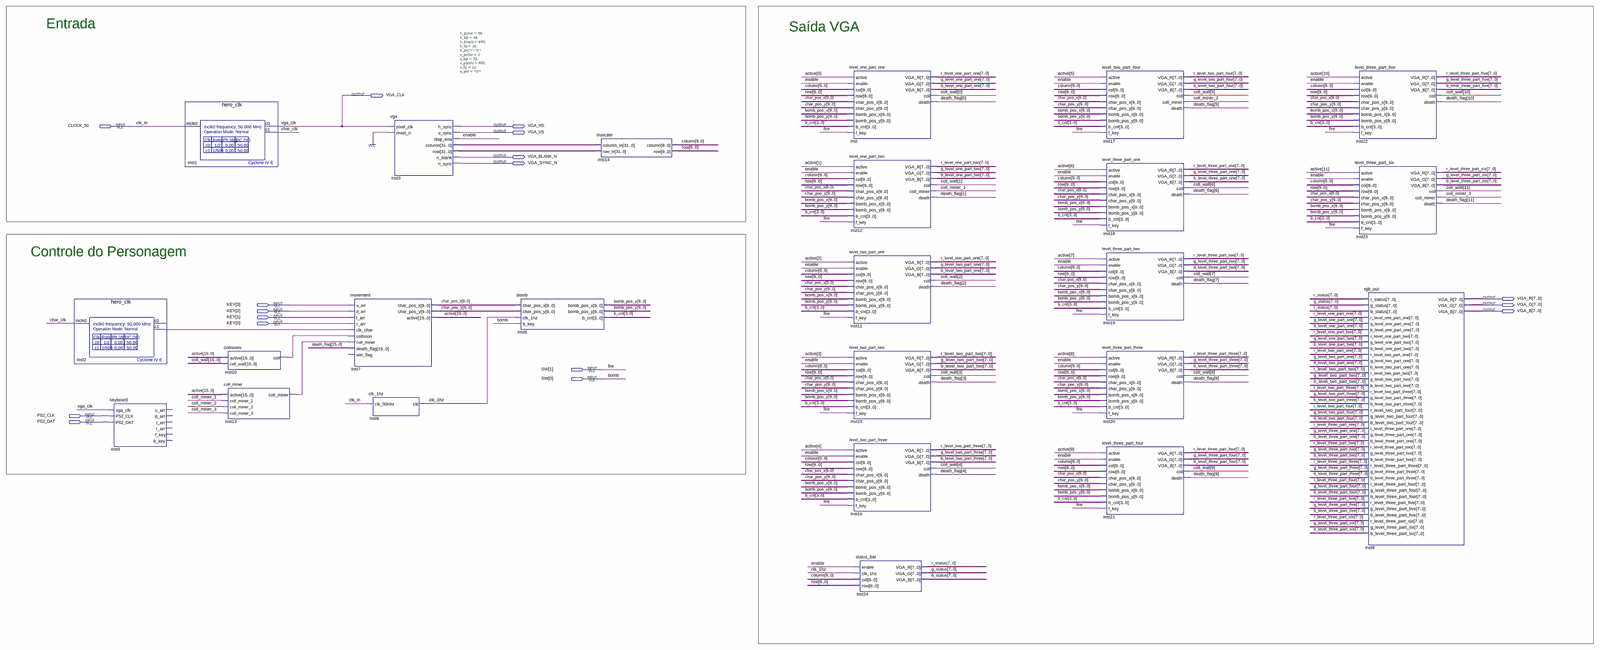
[diagram p0: schematic sheet, whole]
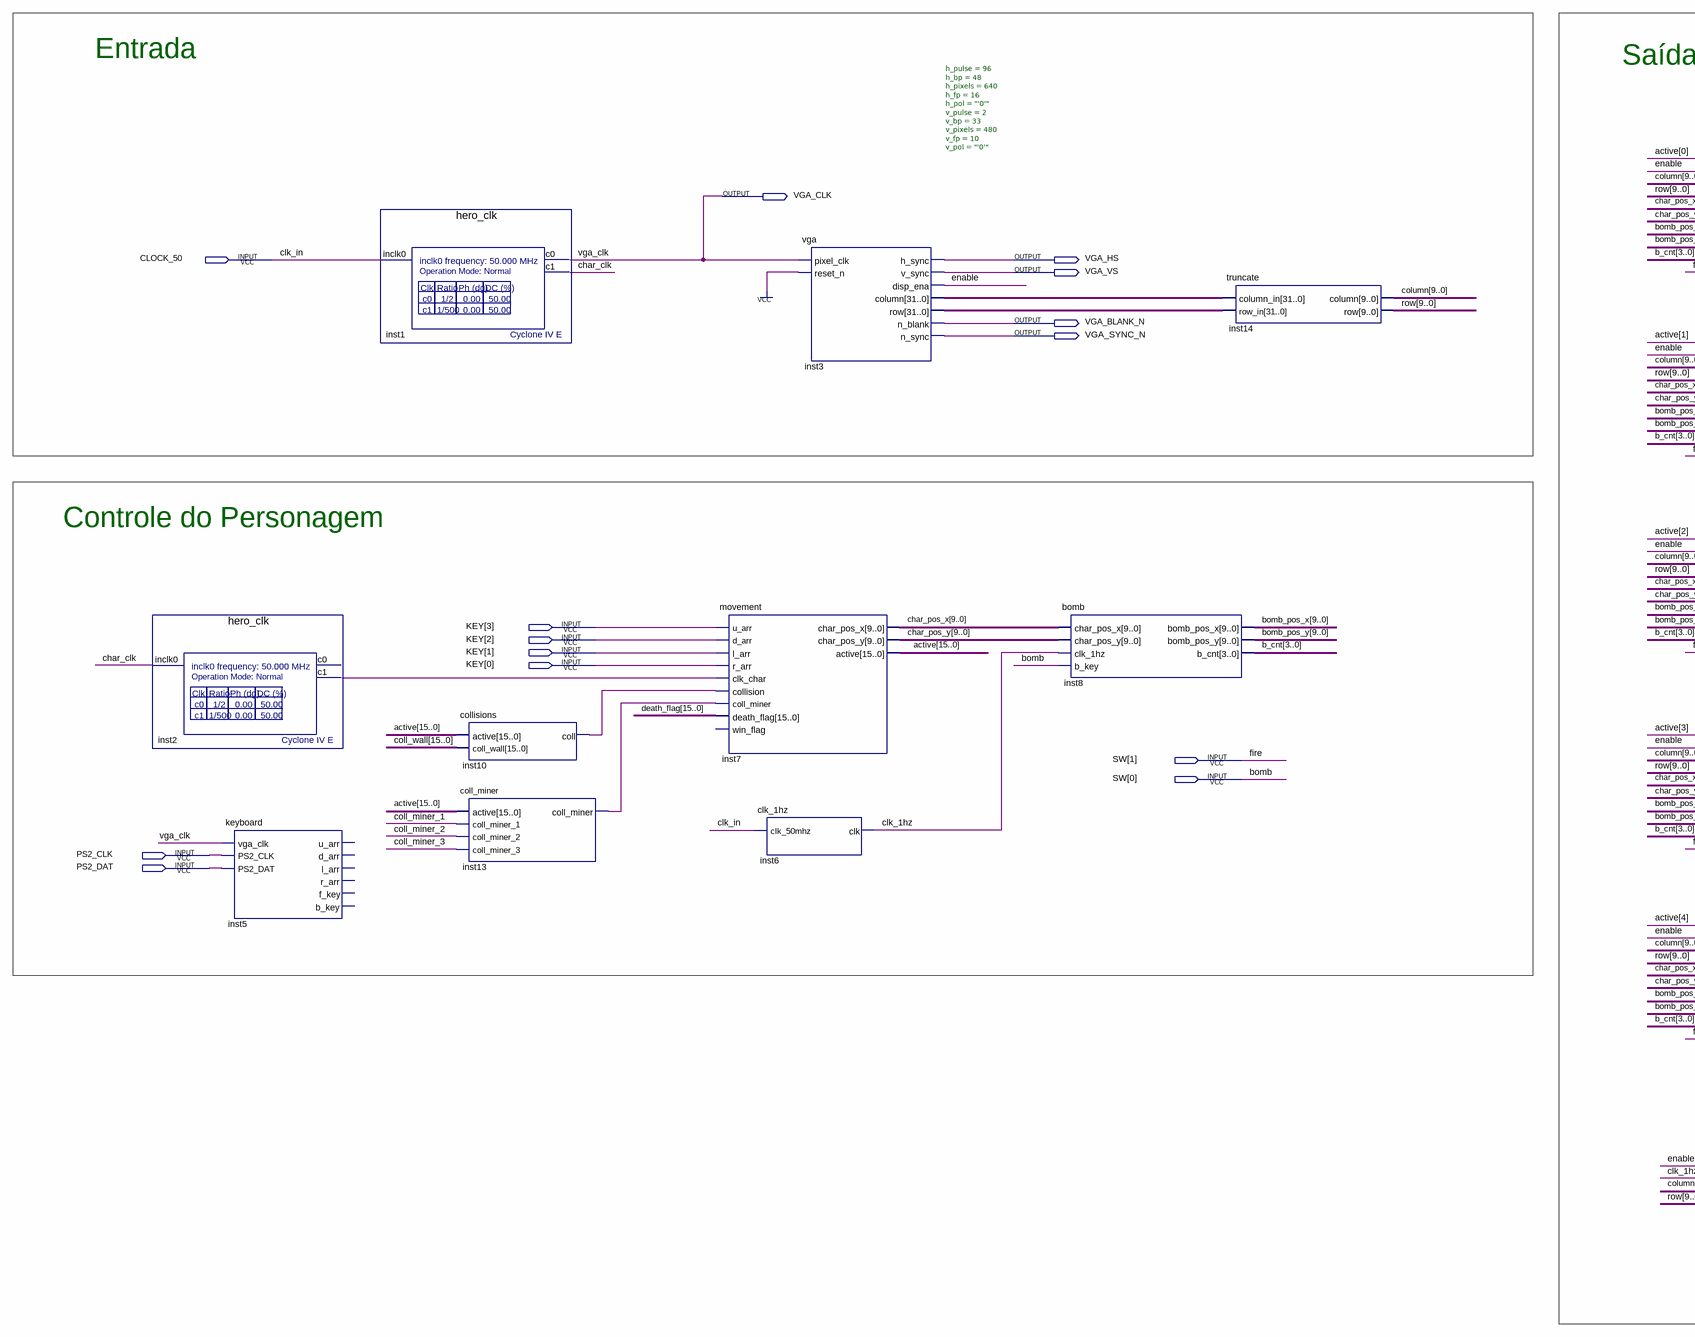
[diagram p1: schematic sheet, left part]
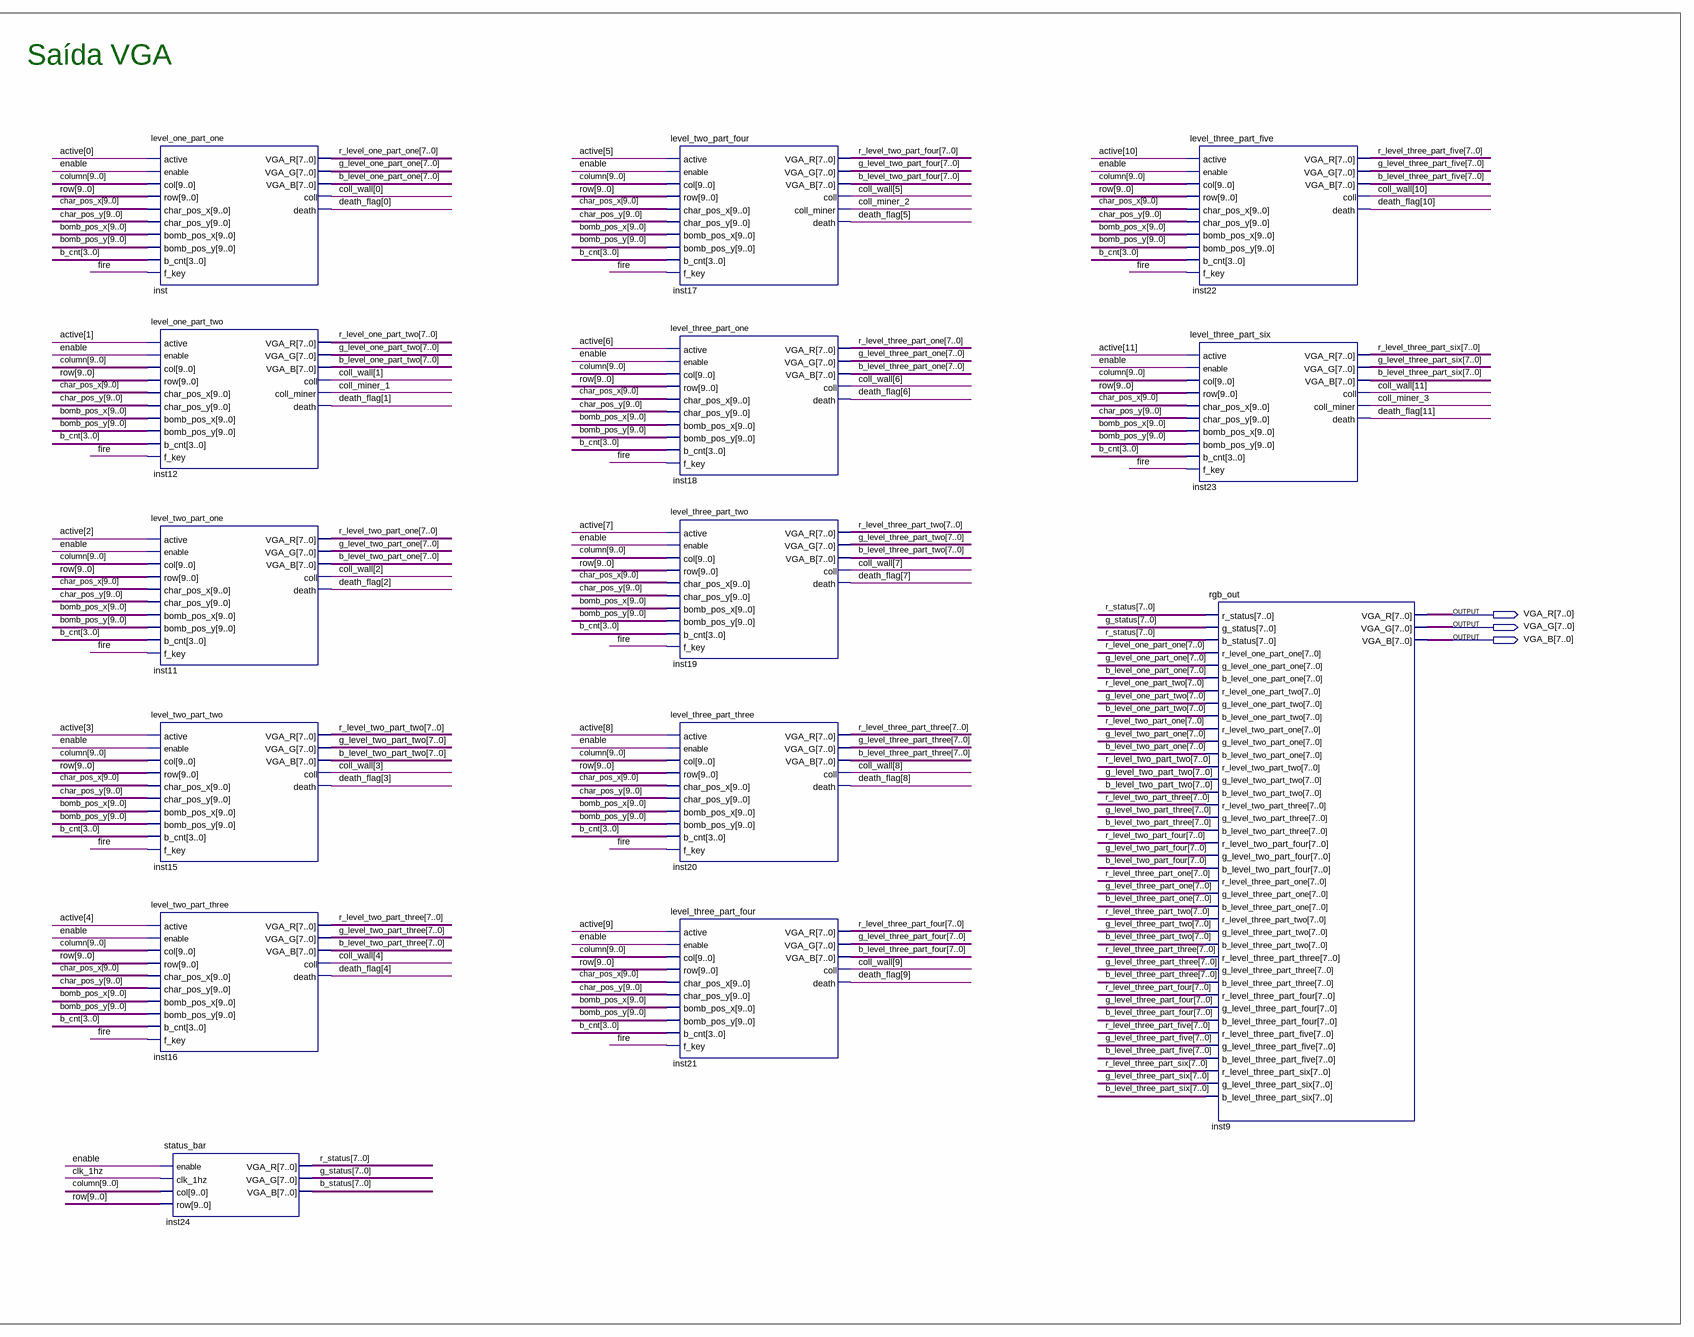
[diagram p2: schematic sheet, right part]
// Quartus schematic hero.bdf as structural Verilog: 24 symbols, 17 pins
module hero (
  input  CLOCK_50,
  input  [3:0] KEY,
  input  [1:0] SW,
  input  PS2_CLK,
  input  PS2_DAT,
  output VGA_CLK,
  output VGA_HS,
  output VGA_VS,
  output VGA_BLANK_N,
  output VGA_SYNC_N,
  output [7:0] VGA_R,
  output [7:0] VGA_G,
  output [7:0] VGA_B
);

  wire char_clk, clk_1hz, coll_miner_1, coll_miner_2, coll_miner_3, enable, inst2_c1, inst10_coll,
       inst13_coll_miner;
  wire [3:0] b_cnt;
  wire [7:0] b_level_one_part_one, b_level_one_part_two, b_level_three_part_five, b_level_three_part_four,
       b_level_three_part_one, b_level_three_part_six, b_level_three_part_three, b_level_three_part_two,
       b_level_two_part_four, b_level_two_part_one, b_level_two_part_three, b_level_two_part_two, b_status,
       g_level_one_part_one, g_level_one_part_two, g_level_three_part_five, g_level_three_part_four,
       g_level_three_part_one, g_level_three_part_six, g_level_three_part_three, g_level_three_part_two,
       g_level_two_part_four, g_level_two_part_one, g_level_two_part_three, g_level_two_part_two, g_status,
       r_level_one_part_one, r_level_one_part_two, r_level_three_part_five, r_level_three_part_four,
       r_level_three_part_one, r_level_three_part_six, r_level_three_part_three, r_level_three_part_two,
       r_level_two_part_four, r_level_two_part_one, r_level_two_part_three, r_level_two_part_two, r_status;
  wire [9:0] bomb_pos_x, bomb_pos_y, char_pos_x, char_pos_y, column, row;
  wire [15:0] active, coll_wall, death_flag;
  wire [31:0] inst3_column, inst3_row;

  hero_clk inst2 (.inclk0(char_clk), .c1(inst2_c1));  // open: c0
  keyboard inst5 (
    .vga_clk(VGA_CLK), .PS2_CLK(PS2_CLK), .PS2_DAT(PS2_DAT));  // open: u_arr, d_arr, l_arr, r_arr, f_key, b_key
  hero_clk inst1 (.inclk0(CLOCK_50), .c0(VGA_CLK), .c1(char_clk));
  collisions inst10 (.active(active), .coll_wall(coll_wall), .coll(inst10_coll));
  coll_miner inst13 (
    .active(active), .coll_miner_1(coll_miner_1), .coll_miner_2(coll_miner_2), .coll_miner_3(coll_miner_3),
    .coll_miner(inst13_coll_miner));
  movement inst7 (
    .u_arr(KEY[3]), .d_arr(KEY[2]), .l_arr(KEY[1]), .r_arr(KEY[0]), .clk_char(inst2_c1),
    .collision(inst10_coll), .coll_miner(inst13_coll_miner), .death_flag(death_flag),
    .char_pos_x(char_pos_x), .char_pos_y(char_pos_y), .active(active));  // open: win_flag
  clk_1hz inst6 (.clk_50mhz(CLOCK_50), .clk(clk_1hz));
  vga #(.h_pulse(96), .h_bp(48), .h_pixels(640), .h_fp(16), .h_pol("'0'"), .v_pulse(2), .v_bp(33), .v_pixels(480), .v_fp(10), .v_pol("'0'")) inst3 (
    .pixel_clk(VGA_CLK), .reset_n(1'b1), .h_sync(VGA_HS), .v_sync(VGA_VS), .disp_ena(enable),
    .column(inst3_column), .row(inst3_row), .n_blank(VGA_BLANK_N), .n_sync(VGA_SYNC_N));
  bomb inst8 (
    .char_pos_x(char_pos_x), .char_pos_y(char_pos_y), .clk_1hz(clk_1hz), .b_key(SW[0]),
    .bomb_pos_x(bomb_pos_x), .bomb_pos_y(bomb_pos_y), .b_cnt(b_cnt));
  truncate inst14 (.column_in(inst3_column), .row_in(inst3_row), .column(column), .row(row));
  level_one_part_one inst (
    .active(active[0]), .enable(enable), .col(column), .row(row), .char_pos_x(char_pos_x),
    .char_pos_y(char_pos_y), .bomb_pos_x(bomb_pos_x), .bomb_pos_y(bomb_pos_y), .b_cnt(b_cnt), .f_key(SW[1]),
    .VGA_R(r_level_one_part_one), .VGA_G(g_level_one_part_one), .VGA_B(b_level_one_part_one),
    .coll(coll_wall[0]), .death(death_flag[0]));
  level_one_part_two inst12 (
    .active(active[1]), .enable(enable), .col(column), .row(row), .char_pos_x(char_pos_x),
    .char_pos_y(char_pos_y), .bomb_pos_x(bomb_pos_x), .bomb_pos_y(bomb_pos_y), .b_cnt(b_cnt), .f_key(SW[1]),
    .VGA_R(r_level_one_part_two), .VGA_G(g_level_one_part_two), .VGA_B(b_level_one_part_two),
    .coll(coll_wall[1]), .coll_miner(coll_miner_1), .death(death_flag[1]));
  level_two_part_one inst11 (
    .active(active[2]), .enable(enable), .col(column), .row(row), .char_pos_x(char_pos_x),
    .char_pos_y(char_pos_y), .bomb_pos_x(bomb_pos_x), .bomb_pos_y(bomb_pos_y), .b_cnt(b_cnt), .f_key(SW[1]),
    .VGA_R(r_level_two_part_one), .VGA_G(g_level_two_part_one), .VGA_B(b_level_two_part_one),
    .coll(coll_wall[2]), .death(death_flag[2]));
  level_two_part_two inst15 (
    .active(active[3]), .enable(enable), .col(column), .row(row), .char_pos_x(char_pos_x),
    .char_pos_y(char_pos_y), .bomb_pos_x(bomb_pos_x), .bomb_pos_y(bomb_pos_y), .b_cnt(b_cnt), .f_key(SW[1]),
    .VGA_R(r_level_two_part_two), .VGA_G(g_level_two_part_two), .VGA_B(b_level_two_part_two),
    .coll(coll_wall[3]), .death(death_flag[3]));
  level_two_part_three inst16 (
    .active(active[4]), .enable(enable), .col(column), .row(row), .char_pos_x(char_pos_x),
    .char_pos_y(char_pos_y), .bomb_pos_x(bomb_pos_x), .bomb_pos_y(bomb_pos_y), .b_cnt(b_cnt), .f_key(SW[1]),
    .VGA_R(r_level_two_part_three), .VGA_G(g_level_two_part_three), .VGA_B(b_level_two_part_three),
    .coll(coll_wall[4]), .death(death_flag[4]));
  status_bar inst24 (
    .enable(enable), .clk_1hz(clk_1hz), .col(column), .row(row), .VGA_R(r_status), .VGA_G(g_status),
    .VGA_B(b_status));
  level_two_part_four inst17 (
    .active(active[5]), .enable(enable), .col(column), .row(row), .char_pos_x(char_pos_x),
    .char_pos_y(char_pos_y), .bomb_pos_x(bomb_pos_x), .bomb_pos_y(bomb_pos_y), .b_cnt(b_cnt), .f_key(SW[1]),
    .VGA_R(r_level_two_part_four), .VGA_G(g_level_two_part_four), .VGA_B(b_level_two_part_four),
    .coll(coll_wall[5]), .coll_miner(coll_miner_2), .death(death_flag[5]));
  level_three_part_one inst18 (
    .active(active[6]), .enable(enable), .col(column), .row(row), .char_pos_x(char_pos_x),
    .char_pos_y(char_pos_y), .bomb_pos_x(bomb_pos_x), .bomb_pos_y(bomb_pos_y), .b_cnt(b_cnt), .f_key(SW[1]),
    .VGA_R(r_level_three_part_one), .VGA_G(g_level_three_part_one), .VGA_B(b_level_three_part_one),
    .coll(coll_wall[6]), .death(death_flag[6]));
  level_three_part_two inst19 (
    .active(active[7]), .enable(enable), .col(column), .row(row), .char_pos_x(char_pos_x),
    .char_pos_y(char_pos_y), .bomb_pos_x(bomb_pos_x), .bomb_pos_y(bomb_pos_y), .b_cnt(b_cnt), .f_key(SW[1]),
    .VGA_R(r_level_three_part_two), .VGA_G(g_level_three_part_two), .VGA_B(b_level_three_part_two),
    .coll(coll_wall[7]), .death(death_flag[7]));
  level_three_part_three inst20 (
    .active(active[8]), .enable(enable), .col(column), .row(row), .char_pos_x(char_pos_x),
    .char_pos_y(char_pos_y), .bomb_pos_x(bomb_pos_x), .bomb_pos_y(bomb_pos_y), .b_cnt(b_cnt), .f_key(SW[1]),
    .VGA_R(r_level_three_part_three), .VGA_G(g_level_three_part_three), .VGA_B(b_level_three_part_three),
    .coll(coll_wall[8]), .death(death_flag[8]));
  level_three_part_four inst21 (
    .active(active[9]), .enable(enable), .col(column), .row(row), .char_pos_x(char_pos_x),
    .char_pos_y(char_pos_y), .bomb_pos_x(bomb_pos_x), .bomb_pos_y(bomb_pos_y), .b_cnt(b_cnt), .f_key(SW[1]),
    .VGA_R(r_level_three_part_four), .VGA_G(g_level_three_part_four), .VGA_B(b_level_three_part_four),
    .coll(coll_wall[9]), .death(death_flag[9]));
  level_three_part_five inst22 (
    .active(active[10]), .enable(enable), .col(column), .row(row), .char_pos_x(char_pos_x),
    .char_pos_y(char_pos_y), .bomb_pos_x(bomb_pos_x), .bomb_pos_y(bomb_pos_y), .b_cnt(b_cnt), .f_key(SW[1]),
    .VGA_R(r_level_three_part_five), .VGA_G(g_level_three_part_five), .VGA_B(b_level_three_part_five),
    .coll(coll_wall[10]), .death(death_flag[10]));
  level_three_part_six inst23 (
    .active(active[11]), .enable(enable), .col(column), .row(row), .char_pos_x(char_pos_x),
    .char_pos_y(char_pos_y), .bomb_pos_x(bomb_pos_x), .bomb_pos_y(bomb_pos_y), .b_cnt(b_cnt), .f_key(SW[1]),
    .VGA_R(r_level_three_part_six), .VGA_G(g_level_three_part_six), .VGA_B(b_level_three_part_six),
    .coll(coll_wall[11]), .coll_miner(coll_miner_3), .death(death_flag[11]));
  rgb_out inst9 (
    .r_status(r_status), .g_status(g_status), .b_status(r_status),
    .r_level_one_part_one(r_level_one_part_one), .g_level_one_part_one(g_level_one_part_one),
    .b_level_one_part_one(b_level_one_part_one), .r_level_one_part_two(r_level_one_part_two),
    .g_level_one_part_two(g_level_one_part_two), .b_level_one_part_two(b_level_one_part_two),
    .r_level_two_part_one(r_level_two_part_one), .g_level_two_part_one(g_level_two_part_one),
    .b_level_two_part_one(b_level_two_part_one), .r_level_two_part_two(r_level_two_part_two),
    .g_level_two_part_two(g_level_two_part_two), .b_level_two_part_two(b_level_two_part_two),
    .r_level_two_part_three(r_level_two_part_three), .g_level_two_part_three(g_level_two_part_three),
    .b_level_two_part_three(b_level_two_part_three), .r_level_two_part_four(r_level_two_part_four),
    .g_level_two_part_four(g_level_two_part_four), .b_level_two_part_four(b_level_two_part_four),
    .r_level_three_part_one(r_level_three_part_one), .g_level_three_part_one(g_level_three_part_one),
    .b_level_three_part_one(b_level_three_part_one), .r_level_three_part_two(r_level_three_part_two),
    .g_level_three_part_two(g_level_three_part_two), .b_level_three_part_two(b_level_three_part_two),
    .r_level_three_part_three(r_level_three_part_three), .g_level_three_part_three(g_level_three_part_three),
    .b_level_three_part_three(b_level_three_part_three), .r_level_three_part_four(r_level_three_part_four),
    .g_level_three_part_four(g_level_three_part_four), .b_level_three_part_four(b_level_three_part_four),
    .r_level_three_part_five(r_level_three_part_five), .g_level_three_part_five(g_level_three_part_five),
    .b_level_three_part_five(b_level_three_part_five), .r_level_three_part_six(r_level_three_part_six),
    .g_level_three_part_six(g_level_three_part_six), .b_level_three_part_six(b_level_three_part_six),
    .VGA_R(VGA_R), .VGA_G(VGA_G), .VGA_B(VGA_B));

  // Other names for the same wires on the sheet: bomb = SW[0]; clk_in = CLOCK_50; fire = SW[1]

  // Notes on the sheet:
  //   Entrada
  //   Saída VGA
  //   Controle do Personagem
endmodule
